# Altium schematic sheet test_board.SchDoc
size 420 x 297 mm
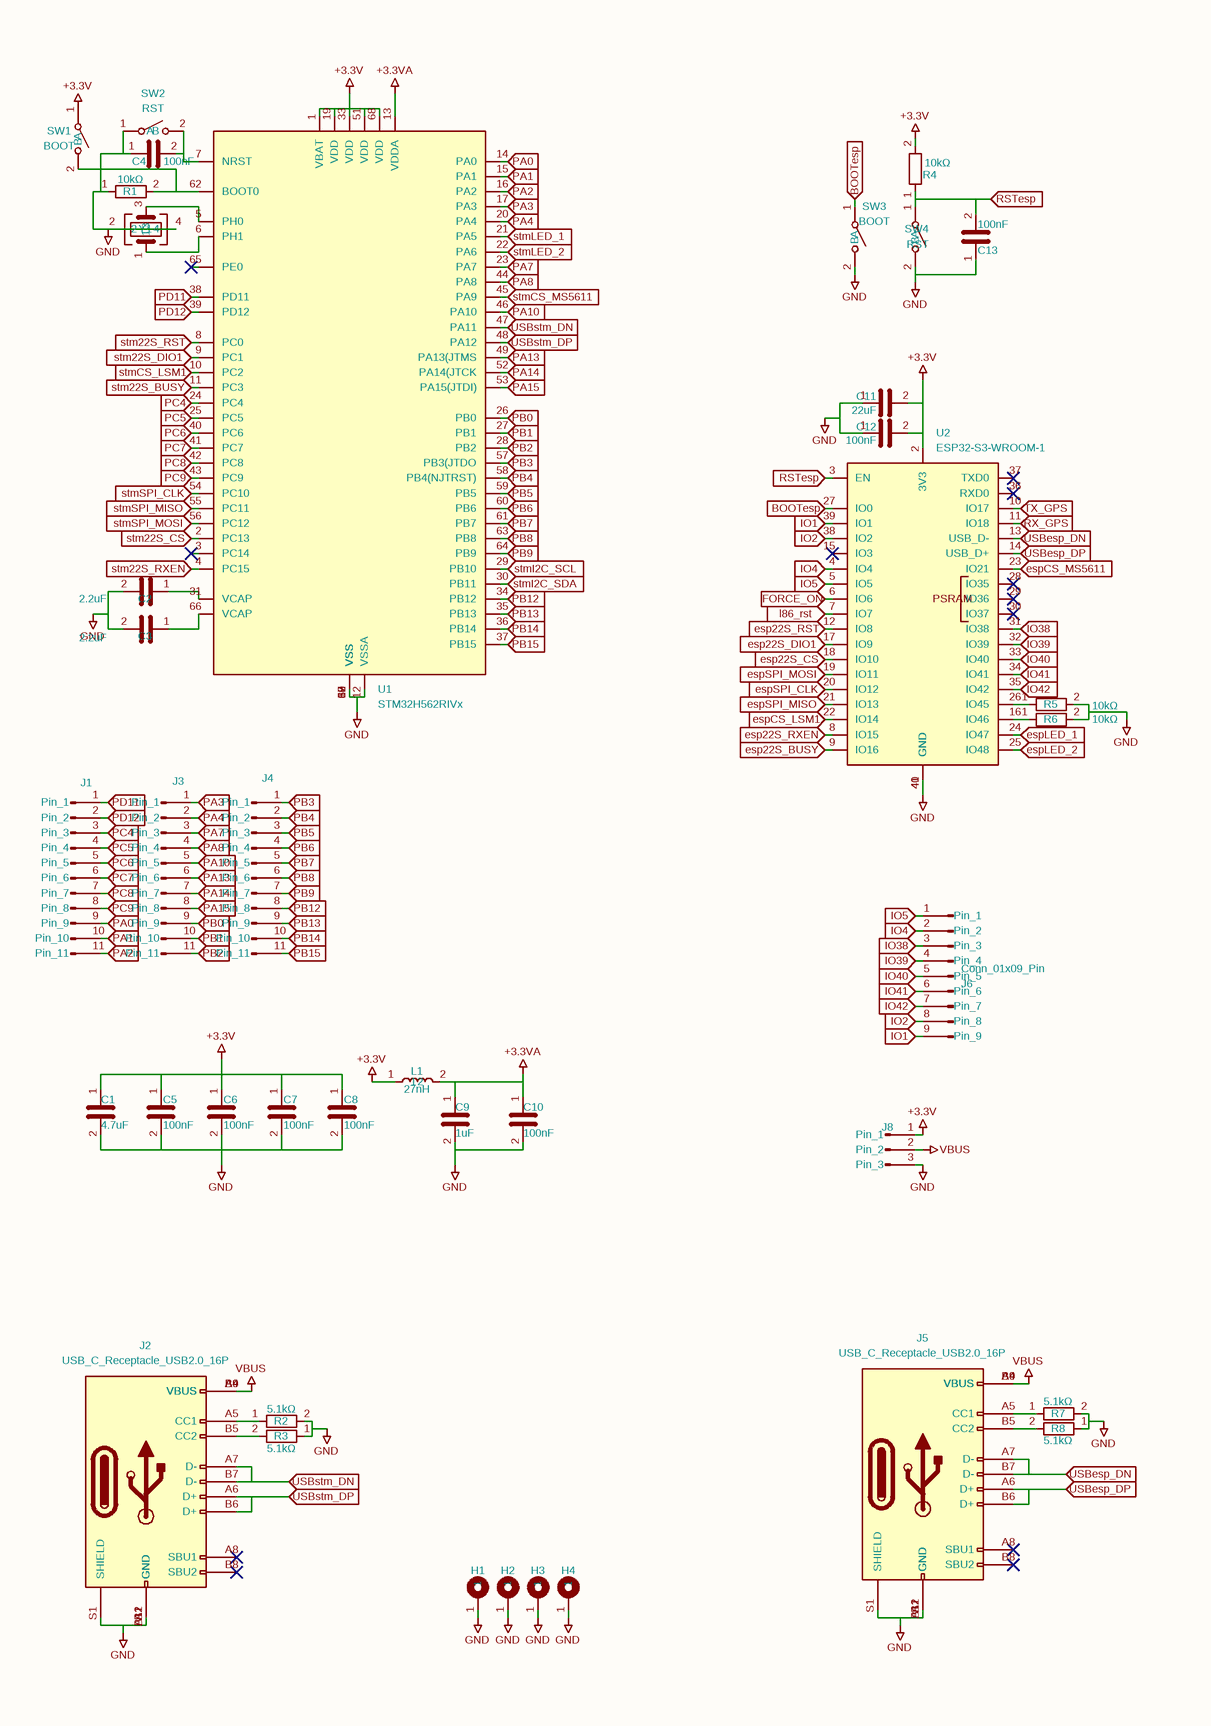
[diagram p0: test_board.SchDoc, left]
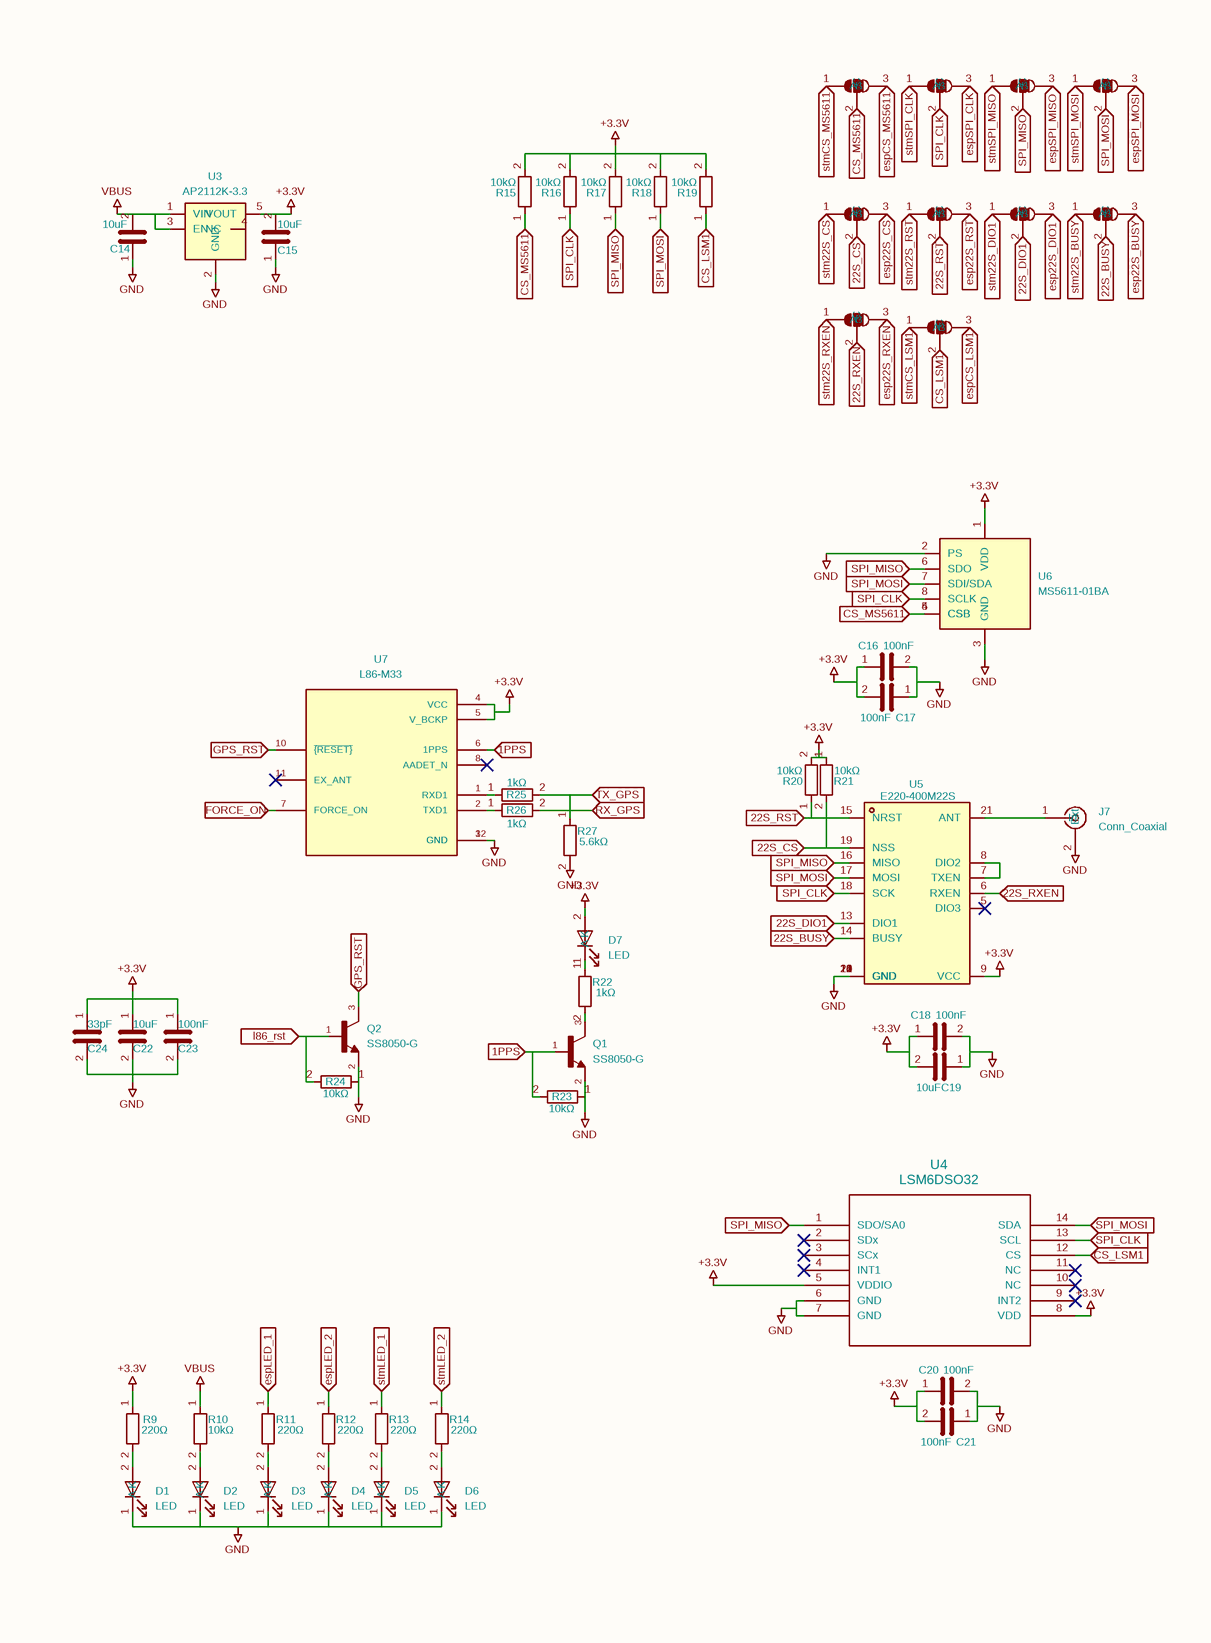
[diagram p1: test_board.SchDoc, right]

## Parts
C1  4.7uF  [C_0603_1608Metric]
C2  2.2uF  [C_0603_1608Metric]
C3  2.2uF  [C_0603_1608Metric]
C4  100nF  [C_0603_1608Metric]
C5  100nF  [C_0603_1608Metric]
C6  100nF  [C_0603_1608Metric]
C7  100nF  [C_0603_1608Metric]
C8  100nF  [C_0603_1608Metric]
C9  1uF  [C_0603_1608Metric]
C10  100nF  [C_0603_1608Metric]
C11  22uF  [C_0805_2012Metric]
C12  100nF  [C_0603_1608Metric]
C13  100nF  [C_0603_1608Metric]
C14  10uF  [C_0603_1608Metric]
C15  10uF  [C_0603_1608Metric]
C16  100nF  [C_0603_1608Metric]
C17  100nF  [C_0603_1608Metric]
C18  100nF  [C_0603_1608Metric]
C19  10uF  [C_0603_1608Metric]
C20  100nF  [C_0603_1608Metric]
C21  100nF  [C_0603_1608Metric]
C22  10uF  [C_0603_1608Metric]
C23  100nF  [C_0603_1608Metric]
C24  33pF  [C_0603_1608Metric]
D1  LED  [LED_0805_2012Metric]
D2  LED  [LED_0805_2012Metric]
D3  LED  [LED_0805_2012Metric]
D4  LED  [LED_0805_2012Metric]
D5  LED  [LED_0805_2012Metric]
D6  LED  [LED_0805_2012Metric]
D7  LED  [LED_0805_2012Metric]
H1  MountingHole_Pad  [MountingHole_3mm_Pad_Via]  (value not drawn)
H2  MountingHole_Pad  [MountingHole_3mm_Pad_Via]  (value not drawn)
H3  MountingHole_Pad  [MountingHole_3mm_Pad_Via]  (value not drawn)
H4  MountingHole_Pad  [MountingHole_3mm_Pad_Via]  (value not drawn)
J1  Conn_01x11_Pin  [PinHeader_1x11_P2.54mm_Vertical]  (value not drawn)
J2  USB_C_Receptacle_USB2.0_16P  [USB_C_Receptacle_GCT_USB4105-xx-A_16P_TopMnt_Horizontal]
J3  Conn_01x11_Pin  [PinHeader_1x11_P2.54mm_Vertical]  (value not drawn)
J4  Conn_01x11_Pin  [PinHeader_1x11_P2.54mm_Vertical]  (value not drawn)
J5  USB_C_Receptacle_USB2.0_16P  [USB_C_Receptacle_GCT_USB4105-xx-A_16P_TopMnt_Horizontal]
J6  Conn_01x09_Pin  [PinSocket_1x09_P2.54mm_Vertical]
J7  Conn_Coaxial  [SMA_Molex_73251-1153_EdgeMount_Horizontal]
J8  Conn_01x03_Pin  [PinSocket_1x03_P2.54mm_Vertical]  (value not drawn)
JP1  SolderJumper_3_Open  [SolderJumper-3_P1.3mm_Open_RoundedPad1.0x1.5mm_NumberLabels]  (value not drawn)
JP2  SolderJumper_3_Open  [SolderJumper-3_P1.3mm_Open_RoundedPad1.0x1.5mm_NumberLabels]  (value not drawn)
JP3  SolderJumper_3_Open  [SolderJumper-3_P1.3mm_Open_RoundedPad1.0x1.5mm_NumberLabels]  (value not drawn)
JP4  SolderJumper_3_Open  [SolderJumper-3_P1.3mm_Open_RoundedPad1.0x1.5mm_NumberLabels]  (value not drawn)
JP5  SolderJumper_3_Open  [SolderJumper-3_P1.3mm_Open_RoundedPad1.0x1.5mm_NumberLabels]  (value not drawn)
JP6  SolderJumper_3_Open  [SolderJumper-3_P1.3mm_Open_RoundedPad1.0x1.5mm_NumberLabels]  (value not drawn)
JP7  SolderJumper_3_Open  [SolderJumper-3_P1.3mm_Open_RoundedPad1.0x1.5mm_NumberLabels]  (value not drawn)
JP8  SolderJumper_3_Open  [SolderJumper-3_P1.3mm_Open_RoundedPad1.0x1.5mm_NumberLabels]  (value not drawn)
JP9  SolderJumper_3_Open  [SolderJumper-3_P1.3mm_Open_RoundedPad1.0x1.5mm_NumberLabels]  (value not drawn)
JP10  SolderJumper_3_Open  [SolderJumper-3_P1.3mm_Open_RoundedPad1.0x1.5mm_NumberLabels]  (value not drawn)
L1  27nH  [L_0603_1608Metric]
Q1  SS8050-G  [TRANS_SS8050-G]
Q2  SS8050-G  [TRANS_SS8050-G]
R1  10kΩ  [R_0603_1608Metric]
R2  5.1kΩ  [R_0603_1608Metric]
R3  5.1kΩ  [R_0603_1608Metric]
R4  10kΩ  [R_0603_1608Metric]
R5  10kΩ  [R_0603_1608Metric]
R6  10kΩ  [R_0603_1608Metric]
R7  5.1kΩ  [R_0603_1608Metric]
R8  5.1kΩ  [R_0603_1608Metric]
R9  220Ω  [R_0603_1608Metric]
R10  10kΩ  [R_0603_1608Metric]
R11  220Ω  [R_0603_1608Metric]
R12  220Ω  [R_0603_1608Metric]
R13  220Ω  [R_0603_1608Metric]
R14  220Ω  [R_0603_1608Metric]
R15  10kΩ  [R_0603_1608Metric]
R16  10kΩ  [R_0603_1608Metric]
R17  10kΩ  [R_0603_1608Metric]
R18  10kΩ  [R_0603_1608Metric]
R19  10kΩ  [R_0603_1608Metric]
R20  10kΩ  [R_0603_1608Metric]
R21  10kΩ  [R_0603_1608Metric]
R22  1kΩ  [R_0603_1608Metric]
R23  10kΩ  [R_0603_1608Metric]
R24  10kΩ  [R_0603_1608Metric]
R25  1kΩ  [R_0603_1608Metric]
R26  1kΩ  [R_0603_1608Metric]
R27  5.6kΩ  [R_0603_1608Metric]
SW1  BOOT  [SW_Tactile_SPST_NO_Straight_CK_PTS636Sx25SMTRLFS]
SW2  RST  [SW_Tactile_SPST_NO_Straight_CK_PTS636Sx25SMTRLFS]
SW3  BOOT  [SW_Tactile_SPST_NO_Straight_CK_PTS636Sx25SMTRLFS]
SW4  RST  [SW_Tactile_SPST_NO_Straight_CK_PTS636Sx25SMTRLFS]
U1  STM32H562RIVx  [QFN-68-1EP_8x8mm_P0.4mm_EP5.2x5.2mm]
U2  ESP32-S3-WROOM-1  [ESP32-S3-WROOM-1U]
U3  AP2112K-3.3  [SOT-23-5]
U4  LSM6DSO32  [LGA-14L_2P5X3X0P83_STM]
U5  E220-400M22S  [WIRELM-SMD_22P-L20.0-W14.0-P1.27-BR]
U6  MS5611-01BA  [LGA-8_3x5mm_P1.25mm]
U7  L86-M33  [XCVR_L86-M33]
Y1  Crystal_GND24  [Crystal_SMD_3225-4Pin_3.2x2.5mm]  (value not drawn)

## Ports
1PPS (in), 22S_BUSY (in), 22S_CS (in), 22S_DIO1 (in), 22S_RST (in), 22S_RXEN (in), BOOTesp (in), CS_LSM1 (in), CS_MS5611 (in), esp22S_BUSY (in), esp22S_CS (in), esp22S_DIO1 (in), esp22S_RST (in), esp22S_RXEN (in), espCS_LSM1 (in), espCS_MS5611 (in), espLED_1 (in), espLED_2 (in), espSPI_CLK (in), espSPI_MISO (in), espSPI_MOSI (in), FORCE_ON (in), GPS_RST (in), IO1 (in), IO2 (in), IO4 (in), IO5 (in), IO38 (in), IO39 (in), IO40 (in), IO41 (in), IO42 (in), l86_rst (in), PA0 (in), PA1 (in), PA2 (in), PA3 (in), PA4 (in), PA7 (in), PA8 (in), PA10 (in), PA13 (in), PA14 (in), PA15 (in), PB0 (in), PB1 (in), PB2 (in), PB3 (in), PB4 (in), PB5 (in), PB6 (in), PB7 (in), PB8 (in), PB9 (in), PB12 (in), PB13 (in), PB14 (in), PB15 (in), PC4 (in), PC5 (in), PC6 (in), PC7 (in), PC8 (in), PC9 (in), PD11 (in), PD12 (in), RSTesp (in), RX_GPS (in), SPI_CLK (in), SPI_MISO (in), SPI_MOSI (in), stm22S_BUSY (in), stm22S_CS (in), stm22S_DIO1 (in), stm22S_RST (in), stm22S_RXEN (in), stmCS_LSM1 (in), stmCS_MS5611 (in), stmI2C_SCL (in), stmI2C_SDA (in), stmLED_1 (in), stmLED_2 (in), stmSPI_CLK (in), stmSPI_MISO (in), stmSPI_MOSI (in), TX_GPS (in), USBesp_DN (in), USBesp_DP (in), USBstm_DN (in), USBstm_DP (in)

## Nets
+3.3V: C1.1 C5.1 C6.1 C7.1 C8.1 C11.2 C12.2 C15.2 C16.1 C17.2 C18.1 C19.2 C20.1 C21.2 C22.1 C23.1 C24.1 D7.2(A) J8.1(Pin_1) L1.1 R4.2 R9.1 R15.2 R16.2 R17.2 R18.2 R19.2 R20.2 R21.1 SW1.1(A) U1.1(VBAT) U1.19(VDD) U1.33(VDD) U1.51(VDD) U1.68(VDD) U2.2(3V3) U3.5(VOUT) U4.5(VDDIO) U4.8(VDD) U5.9(VCC) U6.1(VDD) U7.4(VCC) U7.5(V_BCKP)
+3.3VA: C9.1 C10.1 L1.2 U1.13(VDDA)
GND: C1.2 C2.2 C3.2 C4.1 C5.2 C6.2 C7.2 C8.2 C9.2 C10.2 C11.1 C12.1 C13.1 C14.1 C15.1 C16.2 C17.1 C18.2 C19.1 C20.2 C21.1 C22.2 C23.2 C24.2 D1.1(K) D2.1(K) D3.1(K) D4.1(K) D5.1(K) D6.1(K) H1.1 H2.1 H3.1 H4.1 J2.A1(GND) J2.A12(GND) J2.B1(GND) J2.B12(GND) J2.S1(SHIELD) J5.A1(GND) J5.A12(GND) J5.B1(GND) J5.B12(GND) J5.S1(SHIELD) J7.2(Ext) J8.3(Pin_3) Q1.2 Q2.2 R1.1 R2.2 R3.1 R5.2 R6.2 R7.2 R8.1 R23.1 R24.1 R27.2 SW2.1(A) SW3.2(B) SW4.2(B) U1.12(VSSA) U1.18(VSS) U1.32(VSS) U1.50(VSS) U1.67(VSS) U1.69(VSS) U2.1(GND) U2.40(GND) U2.41(GND) U3.2(GND) U4.6(GND) U4.7(GND) U5.1(GND) U5.2(GND) U5.3(GND) U5.4(GND) U5.10(GND) U5.11(GND) U5.12(GND) U5.20(GND) U5.22(GND) U6.2(PS) U6.3(GND) U7.3(GND) U7.12(GND) Y1.2 Y1.4
VBUS: C14.2 J2.A4(VBUS) J2.A9(VBUS) J2.B4(VBUS) J2.B9(VBUS) J5.A4(VBUS) J5.A9(VBUS) J5.B4(VBUS) J5.B9(VBUS) J8.2(Pin_2) R10.1 U3.1(VIN) U3.3(EN)
1PPS: Q1.1 R23.2 U7.6(1PPS) ; port 1PPS
22S_BUSY: JP10.2(C) U5.14(BUSY) ; port 22S_BUSY
22S_CS: JP2.2(C) R21.2 U5.19(NSS) ; port 22S_CS
22S_DIO1: JP8.2(C) U5.13(DIO1) ; port 22S_DIO1
22S_RST: JP5.2(C) R20.1 U5.15(NRST) ; port 22S_RST
22S_RXEN: JP3.2(C) U5.6(RXEN) ; port 22S_RXEN
BOOTesp: SW3.1(A) U2.27(IO0) ; port BOOTesp
CS_LSM1: JP6.2(C) R19.1 U4.12(CS) ; port CS_LSM1
CS_MS5611: JP1.2(C) R15.1 U6.4(CSB) U6.5(CSB) ; port CS_MS5611
esp22S_BUSY: JP10.3(B) U2.9(IO16) ; port esp22S_BUSY
esp22S_CS: JP2.3(B) U2.18(IO10) ; port esp22S_CS
esp22S_DIO1: JP8.3(B) U2.17(IO9) ; port esp22S_DIO1
esp22S_RST: JP5.3(B) U2.12(IO8) ; port esp22S_RST
esp22S_RXEN: JP3.3(B) U2.8(IO15) ; port esp22S_RXEN
espCS_LSM1: JP6.3(B) U2.22(IO14) ; port espCS_LSM1
espCS_MS5611: JP1.3(B) U2.23(IO21) ; port espCS_MS5611
espLED_1: R11.1 U2.24(IO47) ; port espLED_1
espLED_2: R12.1 U2.25(IO48) ; port espLED_2
espSPI_CLK: JP4.3(B) U2.20(IO12) ; port espSPI_CLK
espSPI_MISO: JP7.3(B) U2.21(IO13) ; port espSPI_MISO
espSPI_MOSI: JP9.3(B) U2.19(IO11) ; port espSPI_MOSI
FORCE_ON: U2.6(IO6) U7.7(FORCE_ON) ; port FORCE_ON
GPS_RST: Q2.3 U7.10(~{{RESET}}) ; port GPS_RST
IO1: J6.9(Pin_9) U2.39(IO1) ; port IO1
IO2: J6.8(Pin_8) U2.38(IO2) ; port IO2
IO4: J6.2(Pin_2) U2.4(IO4) ; port IO4
IO5: J6.1(Pin_1) U2.5(IO5) ; port IO5
IO38: J6.3(Pin_3) U2.31(IO38) ; port IO38
IO39: J6.4(Pin_4) U2.32(IO39) ; port IO39
IO40: J6.5(Pin_5) U2.33(IO40) ; port IO40
IO41: J6.6(Pin_6) U2.34(IO41) ; port IO41
IO42: J6.7(Pin_7) U2.35(IO42) ; port IO42
l86_rst: Q2.1 R24.2 U2.7(IO7) ; port l86_rst
PA0: J1.9(Pin_9) U1.14(PA0) ; port PA0
PA1: J1.10(Pin_10) U1.15(PA1) ; port PA1
PA2: J1.11(Pin_11) U1.16(PA2) ; port PA2
PA3: J3.1(Pin_1) U1.17(PA3) ; port PA3
PA4: J3.2(Pin_2) U1.20(PA4) ; port PA4
PA7: J3.3(Pin_3) U1.23(PA7) ; port PA7
PA8: J3.4(Pin_4) U1.44(PA8) ; port PA8
PA10: J3.5(Pin_5) U1.46(PA10) ; port PA10
PA13: J3.6(Pin_6) U1.49(PA13(JTMS) ; port PA13
PA14: J3.7(Pin_7) U1.52(PA14(JTCK) ; port PA14
PA15: J3.8(Pin_8) U1.53(PA15(JTDI)) ; port PA15
PB0: J3.9(Pin_9) U1.26(PB0) ; port PB0
PB1: J3.10(Pin_10) U1.27(PB1) ; port PB1
PB2: J3.11(Pin_11) U1.28(PB2) ; port PB2
PB3: J4.1(Pin_1) U1.57(PB3(JTDO) ; port PB3
PB4: J4.2(Pin_2) U1.58(PB4(NJTRST)) ; port PB4
PB5: J4.3(Pin_3) U1.59(PB5) ; port PB5
PB6: J4.4(Pin_4) U1.60(PB6) ; port PB6
PB7: J4.5(Pin_5) U1.61(PB7) ; port PB7
PB8: J4.6(Pin_6) U1.63(PB8) ; port PB8
PB9: J4.7(Pin_7) U1.64(PB9) ; port PB9
PB12: J4.8(Pin_8) U1.34(PB12) ; port PB12
PB13: J4.9(Pin_9) U1.35(PB13) ; port PB13
PB14: J4.10(Pin_10) U1.36(PB14) ; port PB14
PB15: J4.11(Pin_11) U1.37(PB15) ; port PB15
PC4: J1.3(Pin_3) U1.24(PC4) ; port PC4
PC5: J1.4(Pin_4) U1.25(PC5) ; port PC5
PC6: J1.5(Pin_5) U1.40(PC6) ; port PC6
PC7: J1.6(Pin_6) U1.41(PC7) ; port PC7
PC8: J1.7(Pin_7) U1.42(PC8) ; port PC8
PC9: J1.8(Pin_8) U1.43(PC9) ; port PC9
PD11: J1.1(Pin_1) U1.38(PD11) ; port PD11
PD12: J1.2(Pin_2) U1.39(PD12) ; port PD12
RSTesp: C13.2 R4.1 SW4.1(A) U2.3(EN) ; port RSTesp
RX_GPS: R26.2 U2.11(IO18) ; port RX_GPS
SPI_CLK: JP4.2(C) R16.1 U4.13(SCL) U5.18(SCK) U6.8(SCLK) ; port SPI_CLK
SPI_MISO: JP7.2(C) R17.1 U4.1(SDO/SA0) U5.16(MISO) U6.6(SDO) ; port SPI_MISO
SPI_MOSI: JP9.2(C) R18.1 U4.14(SDA) U5.17(MOSI) U6.7(SDI/SDA) ; port SPI_MOSI
stm22S_BUSY: JP10.1(A) U1.11(PC3) ; port stm22S_BUSY
stm22S_CS: JP2.1(A) U1.2(PC13) ; port stm22S_CS
stm22S_DIO1: JP8.1(A) U1.9(PC1) ; port stm22S_DIO1
stm22S_RST: JP5.1(A) U1.8(PC0) ; port stm22S_RST
stm22S_RXEN: JP3.1(A) U1.4(PC15) ; port stm22S_RXEN
stmCS_LSM1: JP6.1(A) U1.10(PC2) ; port stmCS_LSM1
stmCS_MS5611: JP1.1(A) U1.45(PA9) ; port stmCS_MS5611
stmI2C_SCL: U1.29(PB10) ; port stmI2C_SCL
stmI2C_SDA: U1.30(PB11) ; port stmI2C_SDA
stmLED_1: R13.1 U1.21(PA5) ; port stmLED_1
stmLED_2: R14.1 U1.22(PA6) ; port stmLED_2
stmSPI_CLK: JP4.1(A) U1.54(PC10) ; port stmSPI_CLK
stmSPI_MISO: JP7.1(A) U1.55(PC11) ; port stmSPI_MISO
stmSPI_MOSI: JP9.1(A) U1.56(PC12) ; port stmSPI_MOSI
TX_GPS: R25.2 R27.1 U2.10(IO17) ; port TX_GPS
USBesp_DN: J5.A7(D-) J5.B7(D-) U2.13(USB_D-) ; port USBesp_DN
USBesp_DP: J5.A6(D+) J5.B6(D+) U2.14(USB_D+) ; port USBesp_DP
USBstm_DN: J2.A7(D-) J2.B7(D-) U1.47(PA11) ; port USBstm_DN
USBstm_DP: J2.A6(D+) J2.B6(D+) U1.48(PA12) ; port USBstm_DP
NetC2_1: C2.1 U1.31(VCAP)
NetC3_1: C3.1 U1.66(VCAP)
NetC4_2: C4.2 SW2.2(B) U1.7(NRST)
NetD1_2: D1.2(A) R9.2
NetD2_2: D2.2(A) R10.2
NetD3_2: D3.2(A) R11.2
NetD4_2: D4.2(A) R12.2
NetD5_2: D5.2(A) R13.2
NetD6_2: D6.2(A) R14.2
NetD7_1: D7.1(K) R22.1
NetJ2_A5: J2.A5(CC1) R2.1
NetJ2_B5: J2.B5(CC2) R3.2
NetJ5_A5: J5.A5(CC1) R7.1
NetJ5_B5: J5.B5(CC2) R8.2
NetJ7_1: J7.1(In) U5.21(ANT)
NetQ1_3: Q1.3 R22.2
NetR1_2: R1.2 SW1.2(B) U1.62(BOOT0)
NetR5_1: R5.1 U2.26(IO45)
NetR6_1: R6.1 U2.16(IO46)
NetR25_1: R25.1 U7.1(RXD1)
NetR26_1: R26.1 U7.2(TXD1)
NetU1_5: U1.5(PH0) Y1.3
NetU1_6: U1.6(PH1) Y1.1
NetU5_7: U5.7(TXEN) U5.8(DIO2)

Not connected (* = marked no-connect by the designer): J2 A8(SBU1)* B8(SBU2)*; J5 A8(SBU1)* B8(SBU2)*; U1 3(PC14)* 65(PE0)*; U2 15(IO3)* 28(IO35)* 29(IO36)* 30(IO37)* 36(RXD0)* 37(TXD0)*; U3 4(NC); U4 2(SDx)* 3(SCx)* 4(INT1)* 9(INT2)* 10(NC)* 11(NC)*; U5 5(DIO3)*; U7 8(AADET_N)* 11(EX_ANT)*

## Notes on the sheet
- 1
- 2
- 3
- 4
- 5
- 6
- 7
- 8
- A
- B
- C
- D
- E
- Title:
- File: test_board.kicad_sch
- Sheet: /
- F
- KiCad E.D.A.  kicad (5.1.4)-1
- Size: A3
- Date:
- Rev:
- Id: 1/1
- (in symbol ESP32-S3-WROOM-1) PSRAM

## Library data of the parts
C1-C24 = C: Description: Unpolarized capacitor
  C1: Value: 4.7uF; Footprint: Capacitor_SMD:C_0603_1608Metric
  C2 C3: Value: 2.2uF; Footprint: Capacitor_SMD:C_0603_1608Metric
  C4-C8 C10 C12 C13 C16-C18 C20 C21 C23: Value: 100nF; Footprint: Capacitor_SMD:C_0603_1608Metric
  C9: Value: 1uF; Footprint: Capacitor_SMD:C_0603_1608Metric
  C11: Value: 22uF; Footprint: Capacitor_SMD:C_0805_2012Metric
  C14 C15 C19 C22: Value: 10uF; Footprint: Capacitor_SMD:C_0603_1608Metric
  C24: Value: 33pF; Footprint: Capacitor_SMD:C_0603_1608Metric
D1-D7 = LED_1: Description: Light emitting diode; Sim.Pins: 1=K 2=A; Value: LED; Footprint: LED_SMD:LED_0805_2012Metric
H1-H4 = MountingHole_Pad: Description: Mounting Hole with connection; Value: MountingHole_Pad; Footprint: MountingHole:MountingHole_3mm_Pad_Via
J1 J3 J4 = Conn_01x11_Pin: Description: Generic connector, single row, 01x11, script generated; Value: Conn_01x11_Pin; Footprint: Connector_PinHeader_2.54mm:PinHeader_1x11_P2.54mm_Vertical
J2 J5 = USB_C_Receptacle_USB2.0_16P: Description: USB 2.0-only 16P Type-C Receptacle connector; Value: USB_C_Receptacle_USB2.0_16P; Footprint: Connector_USB:USB_C_Receptacle_GCT_USB4105-xx-A_16P_TopMnt_Horizontal
J6 = Conn_01x09_Pin: Description: Generic connector, single row, 01x09, script generated; Value: Conn_01x09_Pin; Footprint: Connector_PinSocket_2.54mm:PinSocket_1x09_P2.54mm_Vertical
J7 = Conn_Coaxial: Description: coaxial connector (BNC, SMA, SMB, SMC, Cinch/RCA, LEMO, ...); Value: Conn_Coaxial; Footprint: Connector_Coaxial:SMA_Molex_73251-1153_EdgeMount_Horizontal
J8 = Conn_01x03_Pin: Description: Generic connector, single row, 01x03, script generated; Value: Conn_01x03_Pin; Footprint: Connector_PinSocket_2.54mm:PinSocket_1x03_P2.54mm_Vertical
JP1-JP10 = SolderJumper_3_Open: Description: Solder Jumper, 3-pole, open; Value: SolderJumper_3_Open; Footprint: Jumper:SolderJumper-3_P1.3mm_Open_RoundedPad1.0x1.5mm_NumberLabels
L1 = L: Description: Inductor; Value: 27nH; Footprint: Inductor_SMD:L_0603_1608Metric
Q1 Q2 = SS8050-G: MANUFACTURER: Comchip; MF: Comchip Technology; Description_1: Bipolar (BJT) Transistor NPN 25 V 1.5 A 100MHz 300 mW Surface Mount SOT-23-3; MAXIMUM_PACKAGE_HEIGHT: 1.05 mm; Package: TO-236 Comchip; Price: None; Check_prices: https://www.snapeda.com/parts/SS8050-G/Comchip/view-part/?ref=eda; STANDARD: Manufacturer Recommendations; PARTREV: A; SnapEDA_Link: https://www.snapeda.com/parts/SS8050-G/Comchip/view-part/?ref=snap; MP: SS8050-G; Availability: In Stock; Value: SS8050-G; Footprint: Snapeda:TRANS_SS8050-G
R1-R27 = R: Description: Resistor; Footprint: Resistor_SMD:R_0603_1608Metric
  R1 R4-R6 R10 R15-R21 R23 R24: Value: 10kΩ
  R2 R3 R7 R8: Value: 5.1kΩ
  R9 R11-R14: Value: 220Ω
  R22 R25 R26: Value: 1kΩ
  R27: Value: 5.6kΩ
SW1-SW4 = SW_SPST: Description: Single Pole Single Throw (SPST) switch; Footprint: Button_Switch_SMD:SW_Tactile_SPST_NO_Straight_CK_PTS636Sx25SMTRLFS
  SW1 SW3: Value: BOOT
  SW2 SW4: Value: RST
U1 = STM32H562RIVx: Manufacturer_Part_Number: STM32H5RIV6; Description: STMicroelectronics Arm Cortex-M33 MCU, 2048KB flash, 640KB RAM, 250 MHz, 1.62-3.6V, 53 GPIO, VFQFPN68; Price: free; Value: STM32H562RIVx; Footprint: Package_DFN_QFN:QFN-68-1EP_8x8mm_P0.4mm_EP5.2x5.2mm
U2 = ESP32-S3-WROOM-1: Description: RF Module, ESP32-S3 SoC, Wi-Fi 802.11b/g/n, Bluetooth, BLE, 32-bit, 3.3V, onboard antenna, SMD; Value: ESP32-S3-WROOM-1; Footprint: RF_Module:ESP32-S3-WROOM-1U
U3 = AP2112K-3.3: Description: 600mA low dropout linear regulator, with enable pin, 3.8V-6V input voltage range, 3.3V fixed positive output, SOT-23-5; Value: AP2112K-3.3; Footprint: Package_TO_SOT_SMD:SOT-23-5
U6 = MS5611-01BA: Description: Barometric pressure sensor, 10cm resolution, 10 to 1200 mbar, I2C and SPI interface up to 20MHz, LGA-8; Manufacturer_Part_Number: MS5611-01BA; Price: free; Value: MS5611-01BA; Footprint: Package_LGA:LGA-8_3x5mm_P1.25mm
U7 = L86-M33: Description: L86 is an ultra-compact GNSS POT _Patch on Top_ module with an embedded 18.4mm × 18.4mm × 4.0mm patch antenna and utilizes the MediaTek new generation GNSS chipset MT3333 that achieves the perfect performance; MF: Quectel; Description_1: L86 is an ultra-compact GNSS POT (Patch on Top) module with an embedded 18.4mm × 18.4mm × 4.0mm patch antenna and utilizes the MediaTek new generation GNSS chipset MT3333 that achieves the perfect performance; PACKAGE: None; PRICE: None; Package: LCC-12 Quectel; Check_prices: https://www.snapeda.com/parts/L86-M33/Quectel/view-part/?ref=eda; Price: None; SnapEDA_Link: https://www.snapeda.com/parts/L86-M33/Quectel/view-part/?ref=snap; MP: L86-M33; Availability: In Stock; AVAILABILITY: Unavailable; Value: L86-M33; Footprint: Snapeda:XCVR_L86-M33
Y1 = Crystal_GND24: Description: Four pin crystal, GND on pins 2 and 4; Price: 1.52$; Value: Crystal_GND24; Footprint: Crystal:Crystal_SMD_3225-4Pin_3.2x2.5mm
U4 = LSM6DSO32: Manufacturer_Part_Number: LSM6DSO32; Price: 18.51zl; Value: LSM6DSO32; Footprint: nncpro:LGA-14L_2P5X3X0P83_STM
U5 = E220-400M22S: LCSC Part: C2971737; Value: E220-400M22S; Footprint: EasyEDA:WIRELM-SMD_22P-L20.0-W14.0-P1.27-BR